# Altium schematic sheet Sheet1.SchDoc
size A4
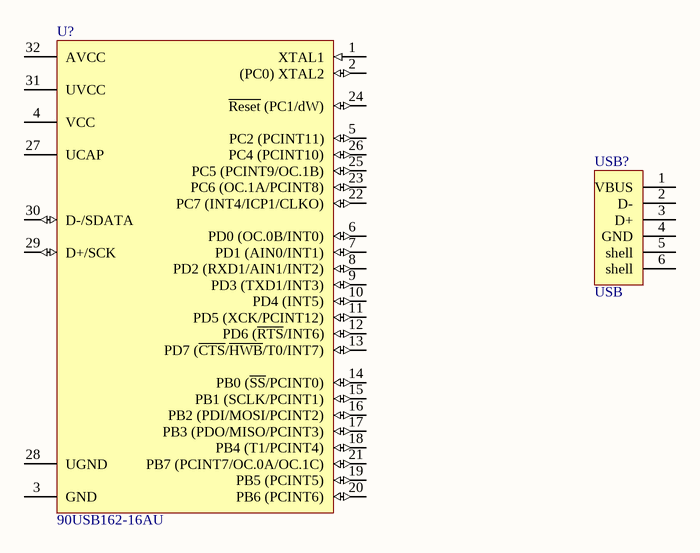
[diagram p0: Sheet1.SchDoc]

## Parts
U?  90USB162-16AU  [32MA_N]
USB?  USB  [Micro_USB]

## Nets

Not connected (* = marked no-connect by the designer): U? 1(XTAL1) 2((PC0)_XTAL2) 3(GND) 4(VCC) 5(PC2_(PCINT11)) 6(PD0_(OC.0B/INT0)) 7(PD1_(AIN0/INT1)) 8(PD2_(RXD1/AIN1/INT2)) 9(PD3_(TXD1/INT3)) 10(PD4_(INT5)) 11(PD5_(XCK/PCINT12)) 12(PD6_(~{RTS}/INT6)) 13(PD7_(~{CTS}/~{HWB}/T0/INT7)) 14(PB0_(~{SS}/PCINT0)) 15(PB1_(SCLK/PCINT1)) 16(PB2_(PDI/MOSI/PCINT2)) 17(PB3_(PDO/MISO/PCINT3)) 18(PB4_(T1/PCINT4)) 19(PB5_(PCINT5)) 20(PB6_(PCINT6)) 21(PB7_(PCINT7/OC.0A/OC.1C)) 22(PC7_(INT4/ICP1/CLKO)) 23(PC6_(OC.1A/PCINT8)) 24(~{Reset}_(PC1/dW)) 25(PC5_(PCINT9/OC.1B)) 26(PC4_(PCINT10)) 27(UCAP) 28(UGND) 29(D+/SCK) 30(D-/SDATA) 31(UVCC) 32(AVCC); USB? 1(VBUS) 2(D-) 3(D+) 4(GND) 5(shell) 6(shell)

## Library data of the parts
U? = 90USB162-16AU: 8-bit AVR Microcontroller, 2.7-5.5V, 16KB Flash, 512 Bytes EEPROM, 512 Bytes SRAM, USB Controller, 32-pin TQFP, Industrial Grade (-40癈 to 85癈); Published: 1-Apr-2010; DatasheetVersion: revE, Nov-2008; PackageVersion: revB, Jul-2007; PackageReference: 32MA; Publisher: Altium Limited; PackageDescription: 32-Lead Thin Profile Plastic Quad Flatpack (TQFP) - 7x7x1mm Body,  0.8 mm Pitch; ComponentLink1Description: Manufacturer Link; ComponentLink1URL: http://www.atmel.com/products/avr/default.asp?; ComponentLink2Description: AT90USB82/162 Datasheet; ComponentLink2URL: http://www.atmel.com/dyn/resources/prod_documents/doc7707.pdf; ComponentLink3Description: AT90USB82/162 Summary; ComponentLink3URL: http://www.atmel.com/dyn/resources/prod_documents/7707S.pdf; ComponentLink4Description: Atmel.com Home; ComponentLink4URL: http://www.atmel.com
USB? = USB: D